# Altium schematic sheet MCU.SchDoc
size A; SheetNumber: 2; SheetTotal: 5
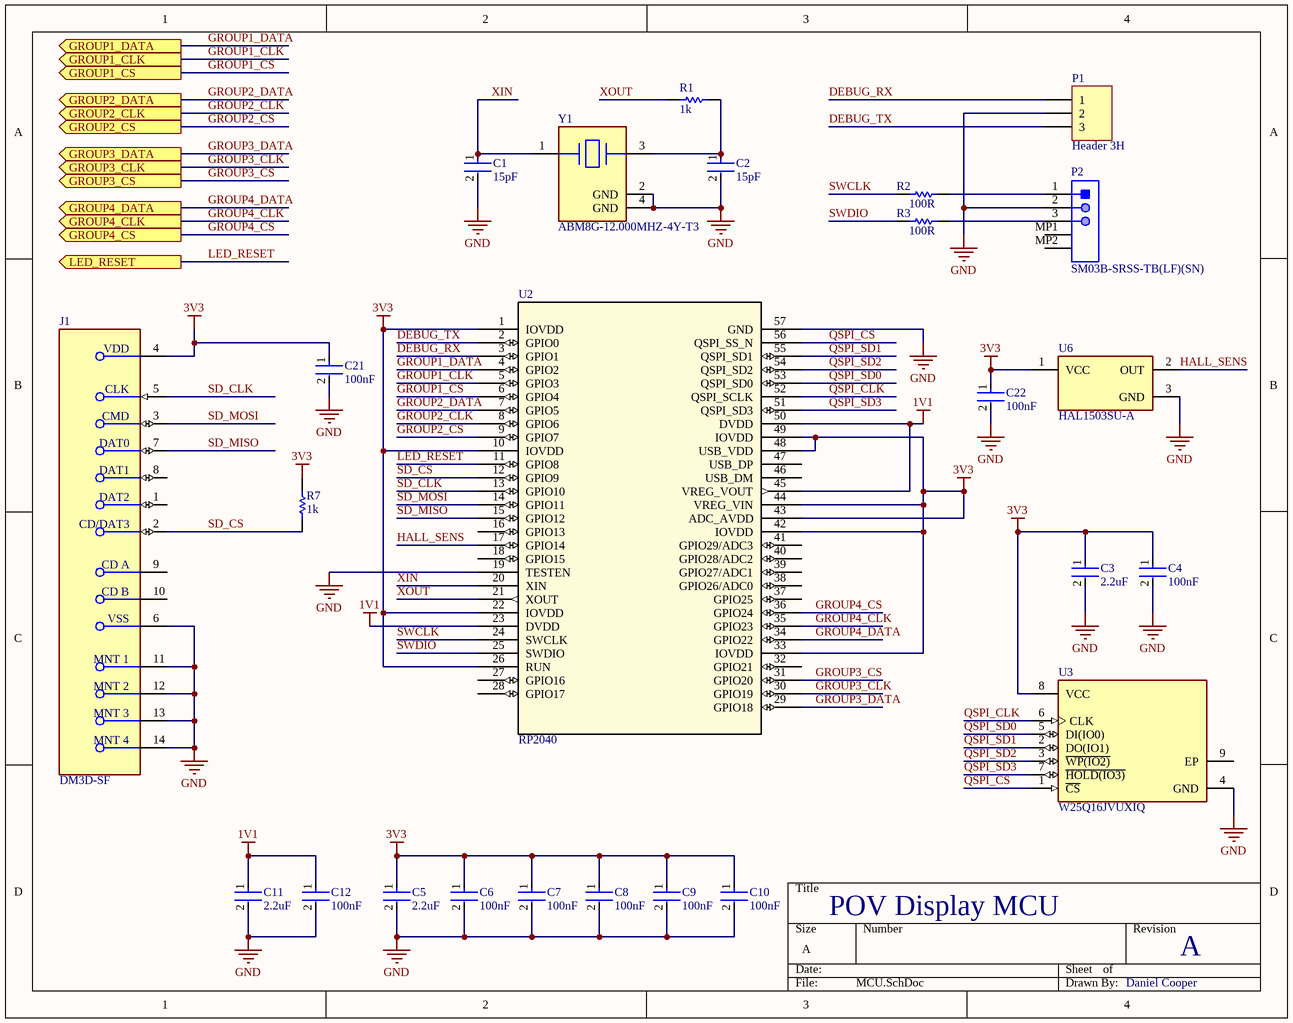
[diagram p0: MCU.SchDoc]

## Parts
C1  15pF  [FP-C0805C-DN-MFG]
C2  15pF  [FP-C0805C-DN-MFG]
C3  2.2uF  [FP-GRM21B-0_15-IPC_A]
C4  100nF  [FP-CL21-IPC_C]
C5  2.2uF  [FP-GRM21B-0_15-IPC_A]
C6  100nF  [FP-CL21-IPC_C]
C7  100nF  [FP-CL21-IPC_C]
C8  100nF  [FP-CL21-IPC_C]
C9  100nF  [FP-CL21-IPC_C]
C10  100nF  [FP-CL21-IPC_C]
C11  2.2uF  [FP-GRM21B-0_15-IPC_A]
C12  100nF  [FP-CL21-IPC_C]
C21  100nF  [FP-CL21-IPC_C]
C22  100nF  [FP-CL21-IPC_C]
J1  DM3D-SF  [FP-DM3D-SF-MFG]
P1  Header 3H  [HDR1X3H]
P2  SM03B-SRSS-TB(LF)(SN)  [JST-SM03B-SRSS-TB_V]
R1  1k  [RESC2013X60X35ML10T20]
R2  100R  [RESC2013X60X35ML10T20]
R3  100R  [RESC2013X60X35ML10T20]
R7  1k  [RESC2013X60X35ML10T20]
U2  RP2040  [IC57_RP2040]
U3  W25Q16JVUXIQ  [FP-UX-MFG]
U6  HAL1503SU-A  [FP-DBZ0003A-MFG]
Y1  ABM8G-12.000MHZ-4Y-T3  [FP-ABM8G-MFG]

## Ports
GROUP1_CLK (out), GROUP1_CS (out), GROUP1_DATA (out), GROUP2_CLK (out), GROUP2_CS (out), GROUP2_DATA (out), GROUP3_CLK (out), GROUP3_CS (out), GROUP3_DATA (out), GROUP4_CLK (out), GROUP4_CS (out), GROUP4_DATA (out), LED_RESET (out)

## Nets
1V1: C11.1 C12.1 U2.23(DVDD) U2.45(VREG_VOUT) U2.50(DVDD)
3V3: C3.1 C4.1 C5.1 C6.1 C7.1 C8.1 C9.1 C10.1 C21.1 C22.1 J1.4(VDD) R7.2 U2.1(IOVDD) U2.10(IOVDD) U2.22(IOVDD) U2.26(RUN) U2.33(IOVDD) U2.42(IOVDD) U2.43(ADC_AVDD) U2.44(VREG_VIN) U2.48(USB_VDD) U2.49(IOVDD) U3.8(VCC) U6.1(VCC)
GND: C1.2 C2.2 C3.2 C4.2 C5.2 C6.2 C7.2 C8.2 C9.2 C10.2 C11.2 C12.2 C21.2 C22.2 J1.6(VSS) J1.11(MNT_1) J1.12(MNT_2) J1.13(MNT_3) J1.14(MNT_4) P1.2 P2.2 U2.19(TESTEN) U2.57(GND) U3.4(GND) U6.3(GND) Y1.2(GND) Y1.4(GND)
DEBUG_RX: P1.1 U2.3(GPIO1)
DEBUG_TX: P1.3 U2.2(GPIO0)
GROUP1_CLK: U2.5(GPIO3) ; port GROUP1_CLK
GROUP1_CS: U2.6(GPIO4) ; port GROUP1_CS
GROUP1_DATA: U2.4(GPIO2) ; port GROUP1_DATA
GROUP2_CLK: U2.8(GPIO6) ; port GROUP2_CLK
GROUP2_CS: U2.9(GPIO7) ; port GROUP2_CS
GROUP2_DATA: U2.7(GPIO5) ; port GROUP2_DATA
GROUP3_CLK: U2.30(GPIO19) ; port GROUP3_CLK
GROUP3_CS: U2.31(GPIO20) ; port GROUP3_CS
GROUP3_DATA: U2.29(GPIO18) ; port GROUP3_DATA
GROUP4_CLK: U2.35(GPIO23) ; port GROUP4_CLK
GROUP4_CS: U2.36(GPIO24) ; port GROUP4_CS
GROUP4_DATA: U2.34(GPIO22) ; port GROUP4_DATA
HALL_SENS: U2.17(GPIO14) U6.2(OUT)
LED_RESET: U2.11(GPIO8) ; port LED_RESET
QSPI_CLK: U2.52(QSPI_SCLK) U3.6(CLK)
QSPI_CS: U2.56(QSPI_SS_N) U3.1(~{CS})
QSPI_SD0: U2.53(QSPI_SD0) U3.5(DI(IO0))
QSPI_SD1: U2.55(QSPI_SD1) U3.2(DO(IO1))
QSPI_SD2: U2.54(QSPI_SD2) U3.3(~{WP(IO2)})
QSPI_SD3: U2.51(QSPI_SD3) U3.7(~{HOLD(IO3)})
SD_CLK: J1.5(CLK) U2.13(GPIO10)
SD_CS: J1.2(CD/DAT3) R7.1 U2.12(GPIO9)
SD_MISO: J1.7(DAT0) U2.15(GPIO12)
SD_MOSI: J1.3(CMD) U2.14(GPIO11)
SWCLK: R2.1 U2.24(SWCLK)
SWDIO: R3.1 U2.25(SWDIO)
XIN: C1.1 U2.20(XIN) Y1.1
XOUT: R1.1 U2.21(XOUT)
NetC2_1: C2.1 R1.2 Y1.3
NetP2_1: P2.1 R2.2
NetP2_3: P2.3 R3.2

Not connected (* = marked no-connect by the designer): J1 1(DAT2) 8(DAT1) 9(CD_A) 10(CD_B); P2 MP1 MP2; U2 16(GPIO13) 18(GPIO15) 27(GPIO16) 28(GPIO17) 32(GPIO21) 37(GPIO25) 38(GPIO26/ADC0) 39(GPIO27/ADC1) 40(GPIO28/ADC2) 41(GPIO29/ADC3) 46(USB_DM) 47(USB_DP); U3 9(EP)

## Notes on the sheet
- POV Display MCU
- A
- Daniel Cooper

## Library data of the parts
C1 C2 = CMP-2007-00289-2: Cap Ceramic 15pF 50V C0G 5% SMD 0805 125C Plastic T/R; Manufacturer Part Number: C0805C150J5GACTU; Manufacturer: KEMET; Temperature Coefficient: 30ppm/°C; Tolerance: 0.05; Temperature Characteristic: C0G; Capacitance: 15 pF; Category: Cap; Voltage Rating: 50 V; Value: 15 pF; Lead Free: Yes; Material: Ceramic; Device Class L1: Passive Components; ComponentLink2Description: Datasheet; Temperature Range Low: -55°C; Ipc Land Pattern Name: CAPC200125X78; Automotive: No; Temperature: -55°C to +125°C; Digikey Description: Cap Ceramic 15pF 50V C0G 5% SMD 0805 125C Plastic T/R; Package: C0805C-DN; Temperature Range High: +125°C; Device Class L3: Ceramic Capacitors; Octopart: https://octopart.com/c0805c150j5gactu-kemet-97841; Height: 0.88mm; Mouser Description: Multilayer Ceramic Capacitors MLCC - SMD/SMT 50volts 15pF C0G 5%; ComponentLink2URL: https://content.kemet.com/datasheets/KEM_C1003_C0G_SMD.pdf; Device Class L2: Capacitors; RoHS: TRUE
C3 C5 C11 = CMP-06035-028354-1: Chip Multilayer Ceramic Capacitors for General Purpose, 0805, 2.2uF, X7R, 15%, 10%, 25V; Voltage Rating (DC): 25V; Thickness: 1.25mm; Dielectric: X7R; Tolerance: 10%; Length: 2mm; Width: 1.25mm; Capacitance: 2.2uF
C4 C6-C10 C12 C21 C22 = CMP-2000-05017-2: CL21 Series 0805 100nF 50V ±10% Tolerance X7R Multilayer Ceramic Chip Capacitor; Depth: 1.25mm; Height: 0.85mm; Width: 0.049inch; Tolerance: 10%; Case Code (Metric): 2012; Case Code (Imperial): 0805; Material: Ceramic; Thickness: 0.037inch; Min Operating Temperature: -55°C; Contact Plating: Tin; Length: 2mm; Mount: Surface Mount; Voltage Rating (DC): 50V; Lead Free: Lead Free; Dielectric: X7R; Radiation Hardening: No; Capacitance: 100nF; Voltage Rating: 50V; Case/Package: 0805; Packaging: Tape and Reel; Max Operating Temperature: 125°C; Voltage: 50V
J1 = CMP-2000-06166-2: CONN MICRO SD CARD PUSH-PULL; Insulation Resistance: 1GR; Max Voltage Rating (AC): 125V; Gender: Female; Contact Resistance: 100mR; Current Rating: 500mA; Pitch: 1.1mm; Connector Type: Connector; Number of Contacts: 8; Contact Plating: Gold; Number of Rows: 1; Termination: Solder; Contact Material: Copper Alloy; REACH SVHC: No SVHC; Voltage Rating (AC): 125V; Packaging: Tape and Reel; Housing Material: Polymer; Max Operating Temperature: 85°C; Package Quantity: 1; Min Operating Temperature: -25°C; Lead Free: Lead Free; Orientation: Right Angle; Radiation Hardening: No; Flammability Rating: UL94 V-0; Mount: Surface Mount; Depth: 11.45mm; Max Current Rating: 500mA; Length: 11.95mm; Width: 11.95mm
P1 = Header 3H: Header, 3-Pin, Right Angle; LatestRevisionDate: 17-Jul-2002; LatestRevisionNote: Re-released for DXP Platform.; Publisher: Altium Limited
P2 = CMP-2000-07077-1: Male Header, Pitch 1 mm, 1 x 3 Position, Height 2.9 mm, -25 to 85 degC, RoHS, Tape and Reel; Manufacturer: JST; Pitch: 1mm; Style/Orientation: RightAngleHeader/Plug; No of Positions: 3; Package Description: Male Header, Pitch 1 mm, 1 x 3 Position, Height 2.9 mm; Manufacturer URL: http://www.jst.com/home2.html; Package Reference: SM03B-SRSS-TB; Type: ShroudedHeader; Termination: Crimp; Mounting Technology: SurfaceMount; Datasheet Version: 11/2010; Datasheet URL: https://datasheet.ciiva.com/26894/getdatasheetpartid-708885-26894671.pdf
R1 R7 = CMP-2100-03671-1: Chip Resistor, 1 KOhm, +/- 1%, 125 mW, -55 to 155 degC, 0805 (2012 Metric), RoHS, Tape and Reel; Manufacturer: Yageo; Temperature Coefficient: 100ppm/degreesC; Voltage Rating (DC): 150V; Max Power Dissipation: 125mW; Resistance: 1KOhm; Number of Pins: 2; Number of Terminations: 2; Datasheet URL: http://www.yageo.com/NewPortal/yageodocoutput?fileName=/pdf/R-Chip/PYu-RC_Group_51_RoHS_L_5.pdf; Length: 0.079inch; Package Description: 2-Pin Surface Mounted Device, Body 2 x 1.25 mm; Depth: 1.25mm; Height: 0.024inch; Military Standard: Not; Case/Package: 0805; Package Reference: 0805; RoHSCompliant: true; Lead Free: LeadFree; Packaging: TapeandReel; Package Quantity: 1; Datasheet Version: Rev. 5, 10/2016; Tolerance: 1%; Min Operating Temperature: -55degC; Voltage Rating: 150V; Composition: ThickFilm; Case Code (Imperial): 0805; Power Rating: 125mW; Width: 0.049inch; Case Code (Metric): 2012; Manufacturer URL: http://www.yageo.com/; Max Operating Temperature: 155degC; REACH SVHC: Unknown; Termination: SMD/SMT
R2 R3 = CMP-2100-03669-1: Chip Resistor, 100 Ohm, +/-1%, 0.125 W, -55 to 155 degC, 0805 (2012 Metric), RoHS, Tape and Reel; Manufacturer: Yageo; Power Rating: 125mW; Resistance: 100Ohm; Voltage Rating: 150V; Tolerance: 1%; Temperature Coefficient: 100ppm/degreesC; Length: 2mm; Package Description: 2-Pin Surface Mounted Device, Body 2 x 1.25 mm; Case Code (Imperial): 0805; Number of Pins: 2; Termination: SMD/SMT; Lead Pitch: 0.4mm; Package Quantity: 1; Height: 0.024inch; Case Code (Metric): 2012; Number of Terminations: 2; Datasheet Version: Rev. 5, 10/2016; Lead Free: LeadFree; Package Reference: 0805; Composition: ThickFilm; REACH SVHC: Unknown; Voltage Rating (DC): 150V; Min Operating Temperature: -55degC; Packaging: TapeandReel; Military Standard: Not; Case/Package: 0805; Datasheet URL: http://www.yageo.com/NewPortal/yageodocoutput?fileName=/pdf/R-Chip/PYu-RC_Group_51_RoHS_L_5.pdf; Max Operating Temperature: 155degC; Manufacturer URL: http://www.yageo.com/; Max Power Dissipation: 125mW; Width: 0.049inch; Depth: 1.25mm; RoHSCompliant: true
U2 = RP2040: No Description Available; Mfr_Name: Raspberry Pi; RefDes: RefDes; Type: Type
U3 = CMP-78876-000011-1: IC FLASH 16MBIT SPI/QUAD 8USON; RoHS Compliant: Yes
U6 = CMP-04937-000003-1: LP HALL 32FBDBZR; Manufacturer Part Number: DRV5032FBDBZR; Manufacturer: Texas Instruments; Standoff Height: 0.01mm; Output Voltage: 5.5V; Max Junction Temp: +105°C; Output Current: 5mA; Sensor Output: Analog Voltage; Min Supply Voltage: 1.65V; Operating Supply Current: 1.06uA; Sensing Method: Hall Effect; Device Class L3: unset; Digikey Description: LP HALL 32FBDBZR; Ambient Temperature Range High: +85°C; Max Supply Voltage: 5.5V; Octopart: https://octopart.com/drv5032fbdbzr-texas+instruments-81717203; Lead Free: Yes; RoHS: TRUE; Mouser Description: Hall Effect Sensor 5mA Omnipolar 1.8V/2.5V/3.3V/5V 3-Pin SOT-23 T/R; ComponentLink2Description: Datasheet; Package: DBZ0003A; Device Class L2: Magnetic Sensors; Automotive: No; Temperature: -40°C to +85°C; Temperature Range Low: -40°C; Category: IC; Temperature Range High: +85°C; Device Class L1: Sensors; ComponentLink2URL: http://www.ti.com/lit/ds/symlink/drv5032.pdf; Ambient Temperature Range Low: -40°C; Height: 1.12mm
Y1 = CMP-27762-014577-1: Crystal 12MHz ±30ppm (Tol) ±30ppm (Stability) 10pF FUND 120Ω 4-Pin SMD T/R; ESR (Equivalent Series Resistance): 120R; Height: 0.039inch; Load Capacitance: 10pF; Operating Frequency: 12 MHz; REACH SVHC: No SVHC; Series: ABM8G; Series Resistance: 120R; Width: 0.098inch; Case/Package: CSMD; Min Operating Temperature: -10°C; Frequency: 12MHz; Mount: Surface Mount; Frequency Tolerance: 30ppm; Max Operating Temperature: 60°C; Lead Free: Lead Free; Frequency Stability: 30ppm; Depth: 2.5mm; Number of Pins: 4; Length: 3.2mm; Packaging: Tape and Reel